# EAGLE schematic signal-board_v1_21 (EAGLE 7.6.0)
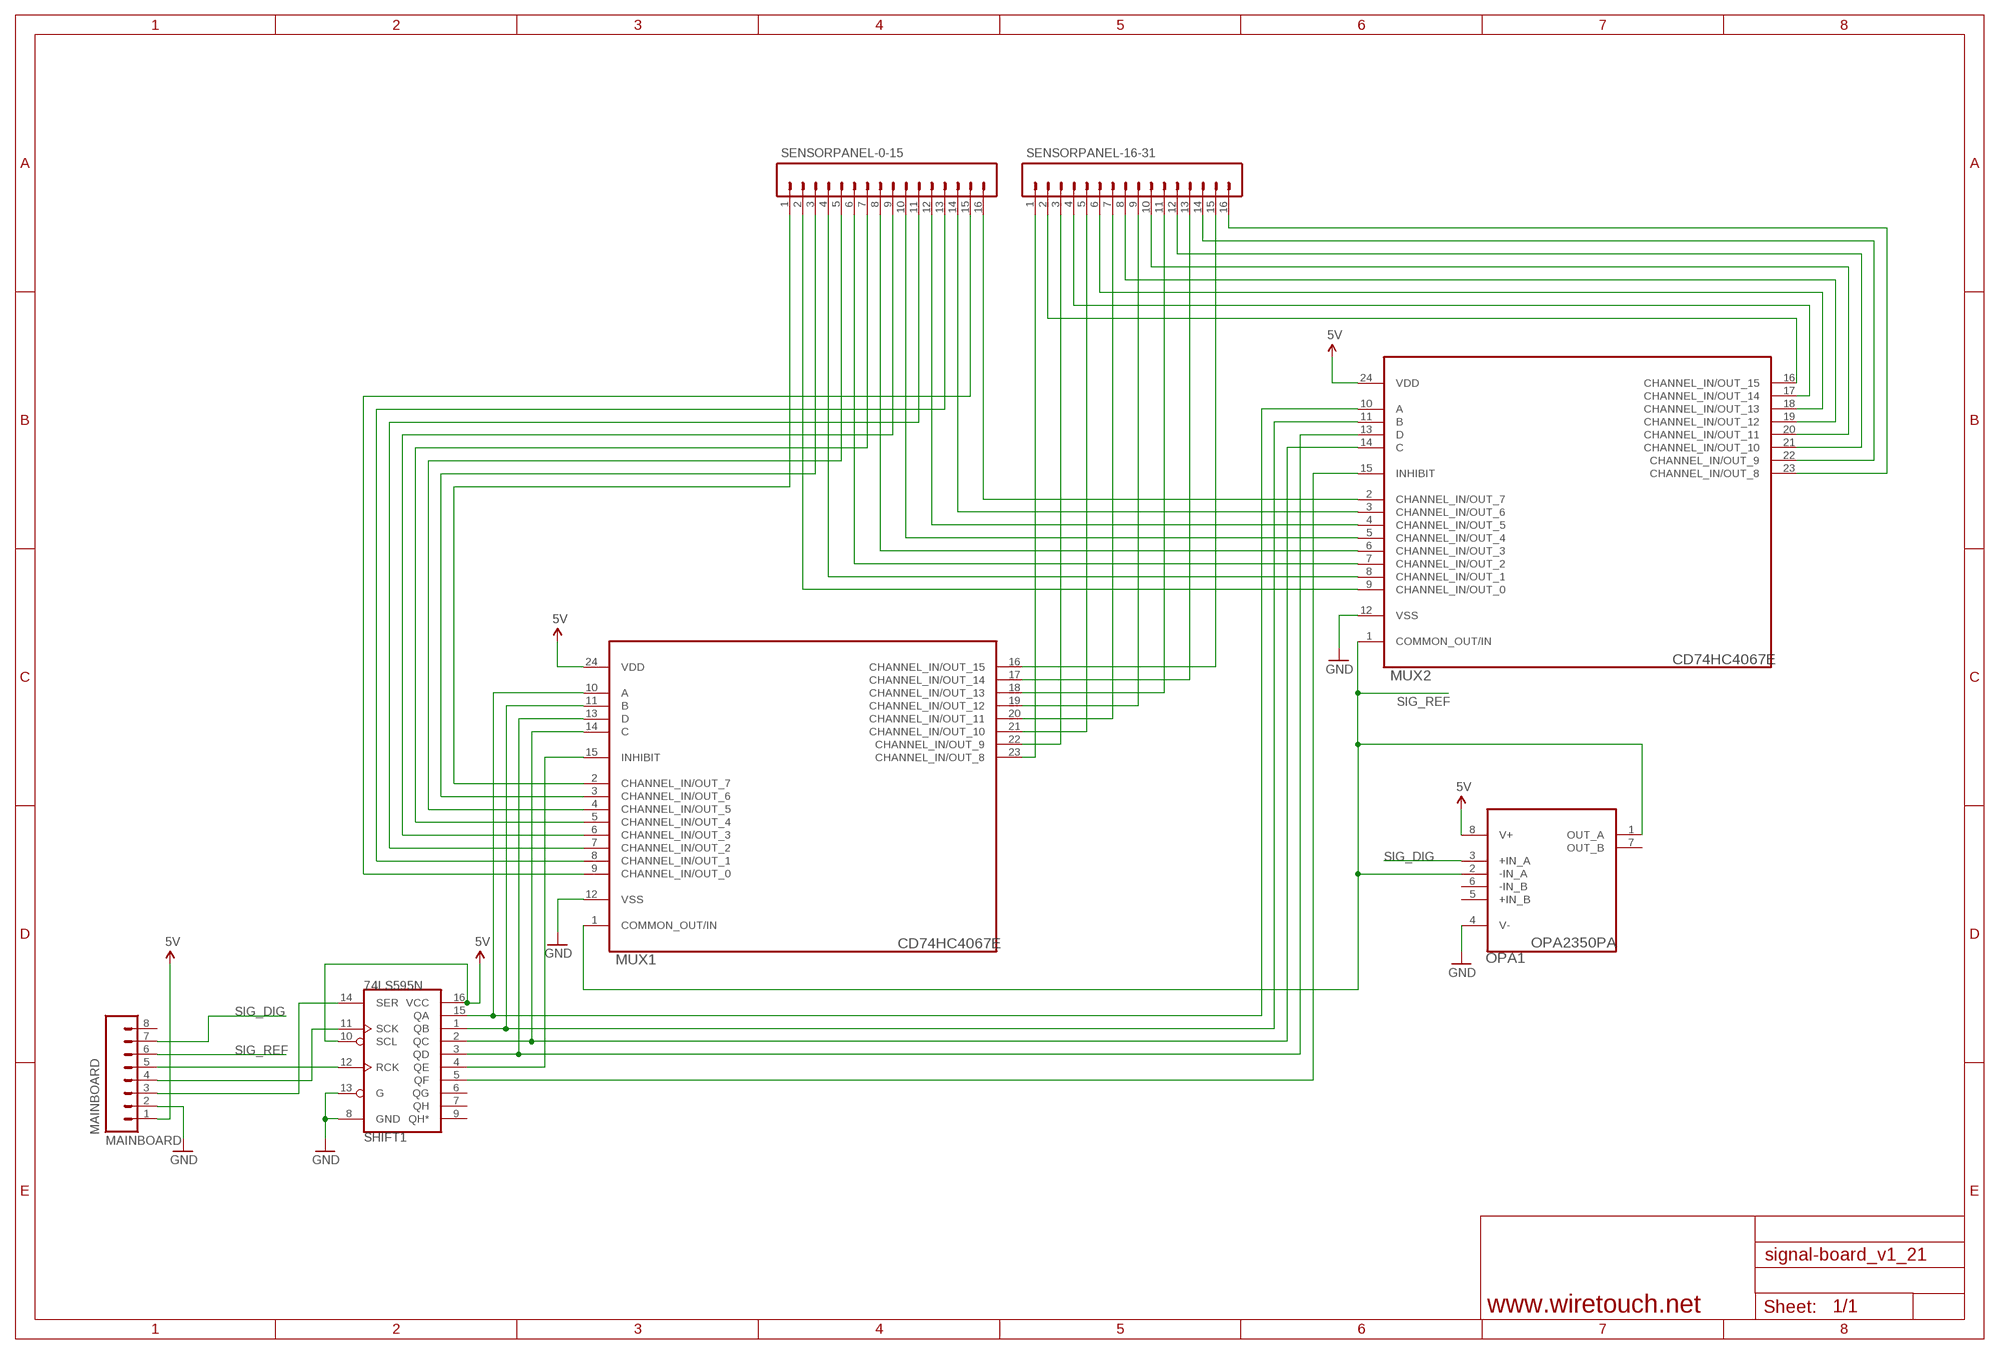
[diagram p0: schematic, sheet 1]

## Parts
MAINBOARD  MAINBOARD  M08LONGPADS  [1X08_LONGPADS]
MUX1  CD74HC4067E  [PDIP24-WIDE-CD74HC4067E]
MUX2  CD74HC4067E  [PDIP24-WIDE-CD74HC4067E]
OPA1  OPA2350PA  [DIP254P762X508-8]
SENSORPANEL-0-15  M16LOCK_LONGPADS  [1X16_LOCK_LONGPADS]
SENSORPANEL-16-31  M16LOCK_LONGPADS  [1X16_LOCK_LONGPADS]
SHIFT1  74LS595N  [DIL16]

## Nets
5V: MAINBOARD.1 MUX1.24(VDD) MUX2.24(VDD) OPA1.8(V+) SHIFT1.10(SCL) SHIFT1.16(VCC)
GND: MAINBOARD.2 MUX1.12(VSS) MUX2.12(VSS) OPA1.4(V-) SHIFT1.8(GND) SHIFT1.13(G)
N$1: MUX1.2(CHANNEL_IN/OUT_7) SENSORPANEL-0-15.1
N$2: MUX1.3(CHANNEL_IN/OUT_6) SENSORPANEL-0-15.3
N$3: MUX1.4(CHANNEL_IN/OUT_5) SENSORPANEL-0-15.5
N$4: MUX1.5(CHANNEL_IN/OUT_4) SENSORPANEL-0-15.7
N$5: MUX1.6(CHANNEL_IN/OUT_3) SENSORPANEL-0-15.9
N$6: MUX1.7(CHANNEL_IN/OUT_2) SENSORPANEL-0-15.11
N$7: MUX1.8(CHANNEL_IN/OUT_1) SENSORPANEL-0-15.13
N$8: MUX1.9(CHANNEL_IN/OUT_0) SENSORPANEL-0-15.15
N$9: MUX1.23(CHANNEL_IN/OUT_8) SENSORPANEL-16-31.1
N$10: MUX1.22(CHANNEL_IN/OUT_9) SENSORPANEL-16-31.3
N$11: MUX1.21(CHANNEL_IN/OUT_10) SENSORPANEL-16-31.5
N$12: MUX1.20(CHANNEL_IN/OUT_11) SENSORPANEL-16-31.7
N$13: MUX1.19(CHANNEL_IN/OUT_12) SENSORPANEL-16-31.9
N$14: MUX1.18(CHANNEL_IN/OUT_13) SENSORPANEL-16-31.11
N$15: MUX1.17(CHANNEL_IN/OUT_14) SENSORPANEL-16-31.13
N$16: MUX1.16(CHANNEL_IN/OUT_15) SENSORPANEL-16-31.15
N$17: MUX2.9(CHANNEL_IN/OUT_0) SENSORPANEL-0-15.2
N$18: MUX2.8(CHANNEL_IN/OUT_1) SENSORPANEL-0-15.4
N$19: MUX2.7(CHANNEL_IN/OUT_2) SENSORPANEL-0-15.6
N$20: MUX2.6(CHANNEL_IN/OUT_3) SENSORPANEL-0-15.8
N$21: MUX2.5(CHANNEL_IN/OUT_4) SENSORPANEL-0-15.10
N$22: MUX2.4(CHANNEL_IN/OUT_5) SENSORPANEL-0-15.12
N$23: MUX2.3(CHANNEL_IN/OUT_6) SENSORPANEL-0-15.14
N$24: MUX2.2(CHANNEL_IN/OUT_7) SENSORPANEL-0-15.16
N$25: MUX2.16(CHANNEL_IN/OUT_15) SENSORPANEL-16-31.2
N$26: MUX2.17(CHANNEL_IN/OUT_14) SENSORPANEL-16-31.4
N$27: MUX2.18(CHANNEL_IN/OUT_13) SENSORPANEL-16-31.6
N$28: MUX2.19(CHANNEL_IN/OUT_12) SENSORPANEL-16-31.8
N$29: MUX2.20(CHANNEL_IN/OUT_11) SENSORPANEL-16-31.10
N$30: MUX2.21(CHANNEL_IN/OUT_10) SENSORPANEL-16-31.12
N$31: MUX2.22(CHANNEL_IN/OUT_9) SENSORPANEL-16-31.14
N$32: MUX2.23(CHANNEL_IN/OUT_8) SENSORPANEL-16-31.16
N$33: MUX1.11(B) MUX2.11(B) SHIFT1.1(QB)
N$34: MUX1.10(A) MUX2.10(A) SHIFT1.15(QA)
N$36: MUX1.14(C) MUX2.14(C) SHIFT1.2(QC)
N$39: MAINBOARD.3 SHIFT1.14(SER)
N$40: MUX1.15(INHIBIT) SHIFT1.4(QE)
N$41: MUX2.15(INHIBIT) SHIFT1.5(QF)
N$42: MAINBOARD.4 SHIFT1.11(SCK)
N$43: MUX1.13(D) MUX2.13(D) SHIFT1.3(QD)
N$44: MAINBOARD.5 SHIFT1.12(RCK)
SIG_DIG: MAINBOARD.7 OPA1.3(+IN_A)
SIG_REF: MAINBOARD.6 MUX1.1(COMMON_OUT/IN) MUX2.1(COMMON_OUT/IN) OPA1.1(OUT_A) OPA1.2(-IN_A)
Unconnected: MAINBOARD.8 OPA1.5(+IN_B) OPA1.6(-IN_B) OPA1.7(OUT_B) SHIFT1.6(QG) SHIFT1.7(QH) SHIFT1.9(QH*)

## Notes on the sheet
- www.wiretouch.net

## Library data of the parts
MAINBOARD = SparkFun-Connectors:M08: Header 8 Standard 8-pin 0.1" header. Use with straight break away headers (SKU : PRT-00116), right angle break away headers (PRT-00553), swiss pins (PRT-00743), machine pins (PRT-00117), and female headers (PRT-00115).
MUX1 MUX2 = gkaindl:CD74HC4067E: MULTIPLEXERS AND DEMULTIPLEXERS
OPA1 = gkaindl:OPA2350PA: OPERATIONAL AMPLIFIER; MPN: OPA2350PA; OC_FARNELL: 4353316; OC_NEWARK: 75C4730; PACKAGE: PDIP; SUPPLIER: Texas Instruments
SENSORPANEL-0-15 SENSORPANEL-16-31 = SparkFun-Connectors:M16: 1x16 .1" header
SHIFT1 = SparkFun-DigitalIC:74*595: 8-bit SHIFT REGISTER, output latch